# EAGLE design MiniARMBoard (EAGLE 8.7.1)
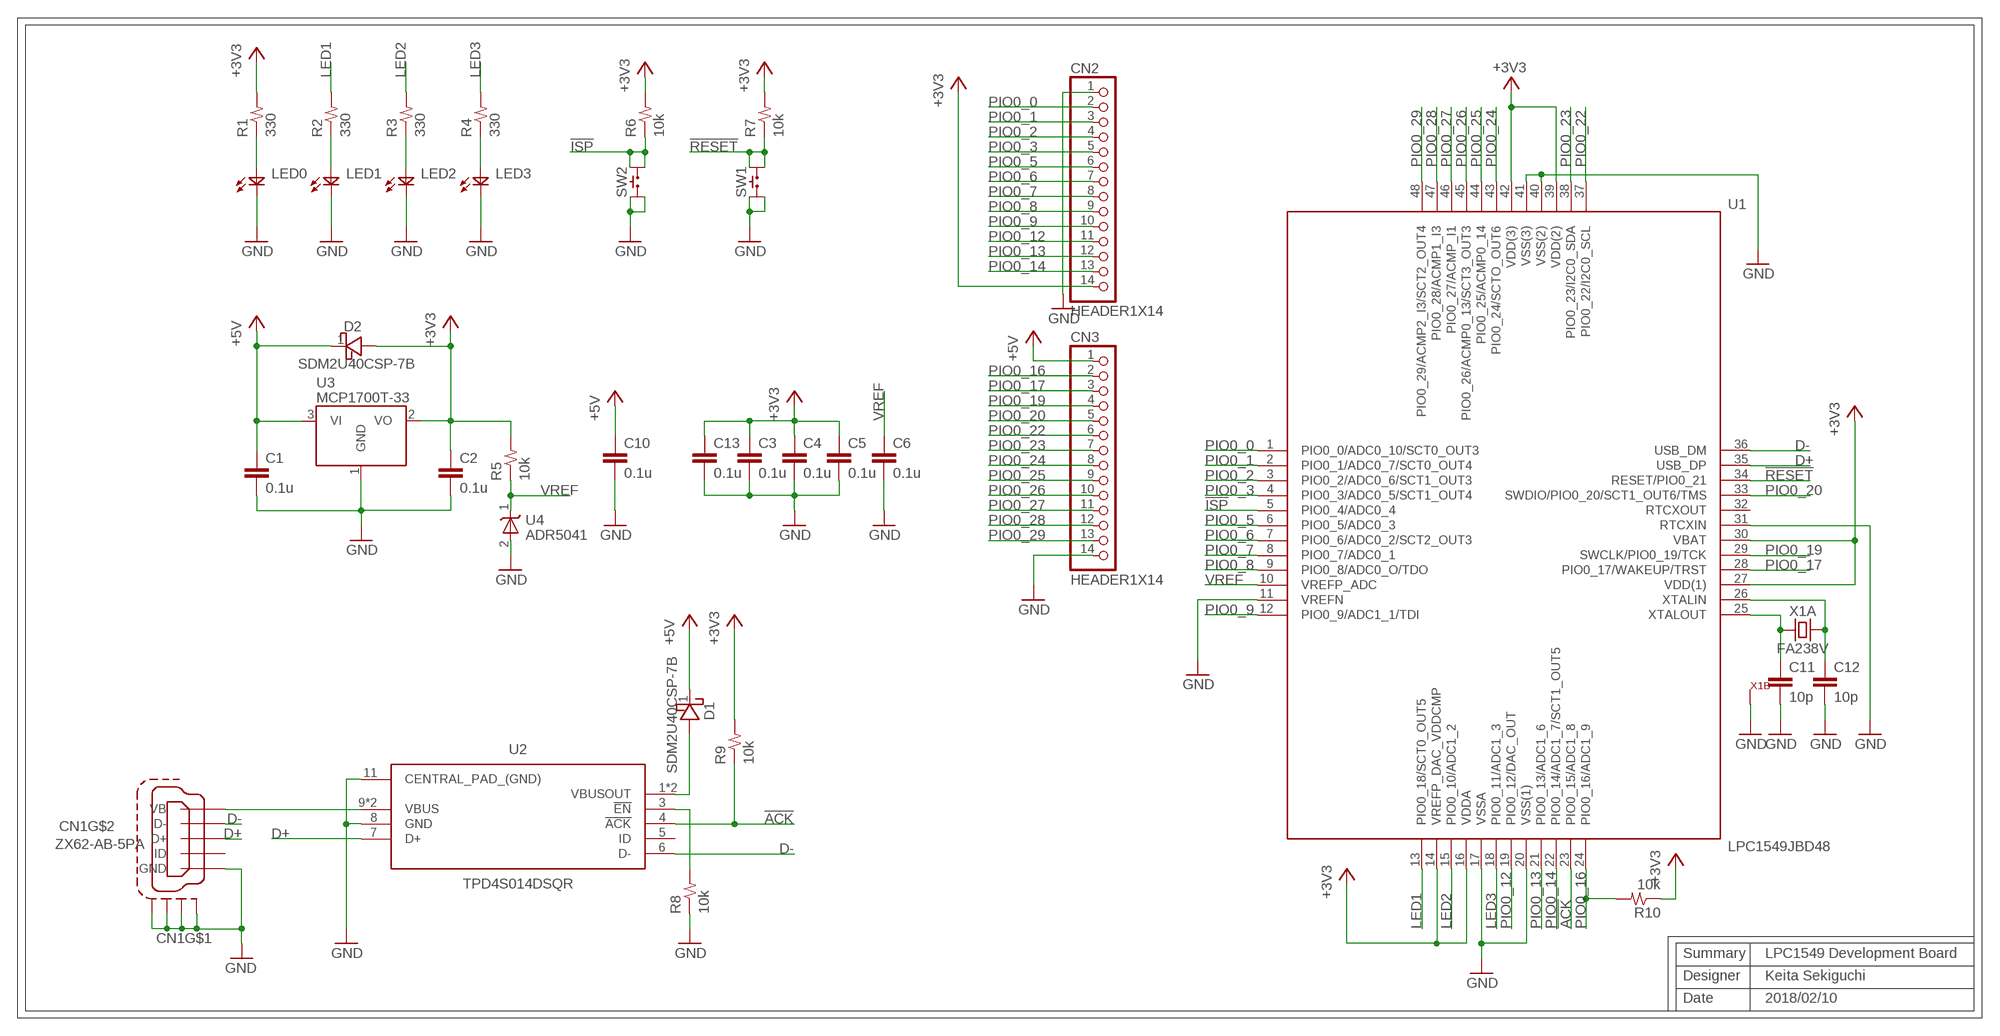
[diagram p0: schematic, sheet 1]

## Parts
C1  0.1u  C1005  [C1005]
C2  0.1u  C1005  [C1005]
C3  0.1u  C1005  [C1005]
C4  0.1u  C1005  [C1005]
C5  0.1u  C1005  [C1005]
C6  0.1u  C1005  [C1005]
C10  0.1u  C1005  [C1005]
C11  10p  C1005  [C1005]
C12  10p  C1005  [C1005]
C13  0.1u  C1005  [C1005]
CN1  ZX62-AB-5PA  J_USB_MICROAB_HIROSE_ZX62-AB-5PA  [J_USB_MICROAB_HIROSE_ZX62-AB-5PA]
CN2  HEADER1X14  [1X14_ROUND]
CN3  HEADER1X14  [1X14_ROUND]
D1  SDM2U40CSP-7B  [X3-WLB1608-2]
D2  SDM2U40CSP-7B  [X3-WLB1608-2]
LED0  LED1608  [LED1608]
LED1  LED1608  [LED1608]
LED2  LED1608  [LED1608]
LED3  LED1608  [LED1608]
R1  330  R1005  [R1005]
R2  330  R1005  [R1005]
R3  330  R1005  [R1005]
R4  330  R1005  [R1005]
R5  10k  R1005  [R1005]
R6  10k  R1005  [R1005]
R7  10k  R1005  [R1005]
R8  10k  R1005  [R1005]
R9  10k  R1005  [R1005]
R10  10k  R1005  [R1005]
SW1  SKRP  [SKRP]
SW2  SKRP  [SKRP]
U1  LPC1549JBD48  [QFP48]
U2  TPD4S014DSQR  [SON40P200X200X80-11N]
U3  MCP1700T-33  [SOT23-3]
U4  ADR5041  [SC70-3]
X1  FA238V  [EPSON_FA238V]

## Nets
!ACK: R9.1 U1.23(PIO0_15/ADC1_8) U2.4(!ACK)
!ISP: R6.1 SW2.B1 SW2.B2 U1.5(PIO0_4/ADC0_4)
!RESET: R7.1 SW1.B1 SW1.B2 U1.34(RESET/PIO0_21)
+3V3: C2.1 C3.1 C4.1 C5.1 C13.1 CN2.14 D2.2(A) R1.2 R5.2 R6.2 R7.2 R9.2 R10.1 U1.14(VREFP_DAC_VDDCMP) U1.16(VDDA) U1.27(VDD(1)) U1.30(VBAT) U1.39(VDD(2)) U1.42(VDD(3)) U3.2(VO)
+5V: C1.1 C10.1 CN3.1 D1.1(K) D2.1(K) U3.3(VI)
D+: CN1.P$3(D+) U1.35(USB_DP) U2.7(D+)
D-: CN1.P$2(D-) U1.36(USB_DM) U2.6(D-)
GND: C1.2 C2.2 C3.2 C4.2 C5.2 C6.2 C10.2 C11.2 C12.2 C13.2 CN1.P$5(GND) CN1.SHIELD1(S1) CN1.SHIELD2(S2) CN1.SHIELD3(S3) CN1.SHIELD4(S4) CN2.1 CN3.14 LED0.K LED1.K LED2.K LED3.K R8.1 SW1.A1 SW1.A2 SW2.A1 SW2.A2 U1.11(VREFN) U1.17(VSSA) U1.20(VSS(1)) U1.31(RTCXIN) U1.40(VSS(2)) U1.41(VSS(3)) U2.8(GND) U2.11(CENTRAL_PAD_(GND)) U3.1(GND) U4.2(A) X1.2 X1.4
LED1: R2.2 U1.13(PIO0_18/SCT0_OUT5)
LED2: R3.2 U1.15(PIO0_10/ADC1_2)
LED3: R4.2 U1.18(PIO0_11/ADC1_3)
N$1: C11.1 U1.25(XTALOUT) X1.1
N$2: C12.1 U1.26(XTALIN) X1.3
N$3: D1.2(A) U2.1(VBUSOUT) U2.2(VBUSOUT)
N$6: R8.2 U2.3(!EN)
N$8: LED0.A R1.1
N$9: LED2.A R3.1
N$16: LED3.A R4.1
N$21: LED1.A R2.1
N$56: CN1.P$1(VB) U2.9(VBUS) U2.10(VBUS)
PIO0_0: CN2.2 U1.1(PIO0_0/ADC0_10/SCT0_OUT3)
PIO0_1: CN2.3 U1.2(PIO0_1/ADC0_7/SCT0_OUT4)
PIO0_2: CN2.4 U1.3(PIO0_2/ADC0_6/SCT1_OUT3)
PIO0_3: CN2.5 U1.4(PIO0_3/ADC0_5/SCT1_OUT4)
PIO0_5: CN2.6 U1.6(PIO0_5/ADC0_3)
PIO0_6: CN2.7 U1.7(PIO0_6/ADC0_2/SCT2_OUT3)
PIO0_7: CN2.8 U1.8(PIO0_7/ADC0_1)
PIO0_8: CN2.9 U1.9(PIO0_8/ADC0_O/TDO)
PIO0_9: CN2.10 U1.12(PIO0_9/ADC1_1/TDI)
PIO0_12: CN2.11 U1.19(PIO0_12/DAC_OUT)
PIO0_13: CN2.12 U1.21(PIO0_13/ADC1_6)
PIO0_14: CN2.13 U1.22(PIO0_14/ADC1_7/SCT1_OUT5)
PIO0_16: CN3.2 R10.2 U1.24(PIO0_16/ADC1_9)
PIO0_17: CN3.3 U1.28(PIO0_17/WAKEUP/TRST)
PIO0_19: CN3.4 U1.29(SWCLK/PIO0_19/TCK)
PIO0_20: CN3.5 U1.33(SWDIO/PIO0_20/SCT1_OUT6/TMS)
PIO0_22: CN3.6 U1.37(PIO0_22/I2C0_SCL)
PIO0_23: CN3.7 U1.38(PIO0_23/I2C0_SDA)
PIO0_24: CN3.8 U1.43(PIO0_24/SCTO_OUT6)
PIO0_25: CN3.9 U1.44(PIO0_25/ACMP0_14)
PIO0_26: CN3.10 U1.45(PIO0_26/ACMP0_13/SCT3_OUT3)
PIO0_27: CN3.11 U1.46(PIO0_27/ACMP_I1)
PIO0_28: CN3.12 U1.47(PIO0_28/ACMP1_I3)
PIO0_29: CN3.13 U1.48(PIO0_29/ACMP2_I3/SCT2_OUT4)
VREF: C6.1 R5.1 U1.10(VREFP_ADC) U4.1(K)
Unconnected: CN1.P$4(ID) U1.32(RTCXOUT) U2.5(ID)

## Notes on the sheet
- Summary | LPC1549 Development Board
- Designer | Keita Sekiguchi
- Date | 2018/02/10

## Library data of the parts
C1-C6 C10-C13 = MotorDriver:C
CN1 = j_usb_hirose_zx62-ab-5pa:J_USB_MICROAB_HIROSE_ZX62-AB-5PA: USB Micro-AB SMT connector Hirose Electric Co Ltd: ZX62-AB-5P
CN2 CN3 = nonolith:HEADER1X14
D1 D2 = SDM2U40CSP-7B:SDM2U40CSP-7B: 2A SCHOTTKY BARRIER RECTIFIER CHIP SCALE PACKAGE Source: Datasheet <https://www.diodes.com/assets/Datasheets/SDM2U40CSP.pdf>; DESCRIPTION: 2A SCHOTTKY BARRIER RECTIFIER CHIP SCALE PACKAGE; HEIGHT: mm; MANUFACTURER_NAME: Diodes Inc.; MANUFACTURER_PART_NUMBER: SDM2U40CSP-7B; SUPPLIER_NAME: RS
LED0 LED1-LED3 = MotorDriver:LED
R1-R10 = MotorDriver:R
SW1 SW2 = MotorDriver:SKRP
U1 = MotorDriver:LPC1549JBD48: NXP - LPC1549JBD48 - 32BIT MCU, CORTEX-M3, 72 MHZ, LQFP-48 Source: Datasheet <http://www.farnell.com/datasheets/1963077.pdf>; DESCRIPTION: NXP - LPC1549JBD48 - 32BIT MCU, CORTEX-M3, 72 MHZ, LQFP-48; HEIGHT: 1.6mm; MANUFACTURER_NAME: NXP; MANUFACTURER_PART_NUMBER: LPC1549JBD48; SUPPLIER_NAME: RS
U2 = TPD4S014DSQR:TPD4S014DSQR: Texas Instruments TPD4S014DSQR, USB Controller, 480Mbit/s, USB 2.0, 10-Pin SON <https://componentsearchengine.com/Images/3/TPD4S014DSQR.jpg> Source: Datasheet <http://www.ti.com/lit/gpn/tpd4s014>; DESCRIPTION: Texas Instruments TPD4S014DSQR, USB Controller, 480Mbit/s, USB 2.0, 10-Pin SON; HEIGHT: 0.8mm; MANUFACTURER_NAME: Texas Instruments; MANUFACTURER_PART_NUMBER: TPD4S014DSQR; RS_PART_NUMBER: 7422968; SUPPLIER_NAME: RS
U3 = MotorDriver:MCP1700T-*
U4 = MotorDriver:ADR504*
X1 = FA238V:FA238V: MHz RANGE CRYSTAL UNIT Source: Datasheet <https://support.epson.biz/td/api/doc_check.php?mode=dl&lang=en&Parts=FA-238V>; DESCRIPTION: MHz RANGE CRYSTAL UNIT; HEIGHT: mm; MANUFACTURER_NAME: Epson ICs; MANUFACTURER_PART_NUMBER: FA238V; SUPPLIER_NAME: RS

## Board
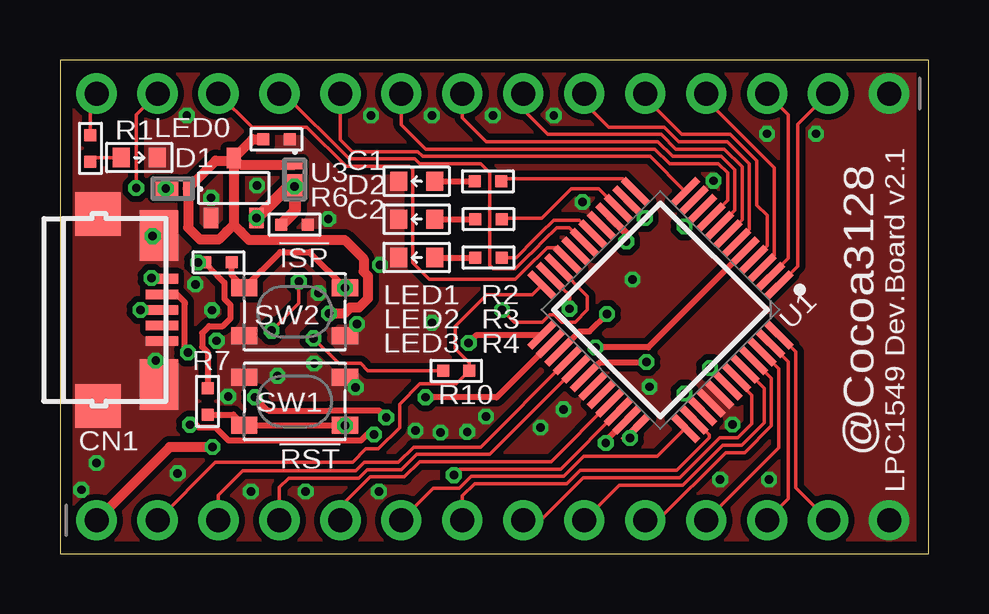
[diagram p1: board, top side]
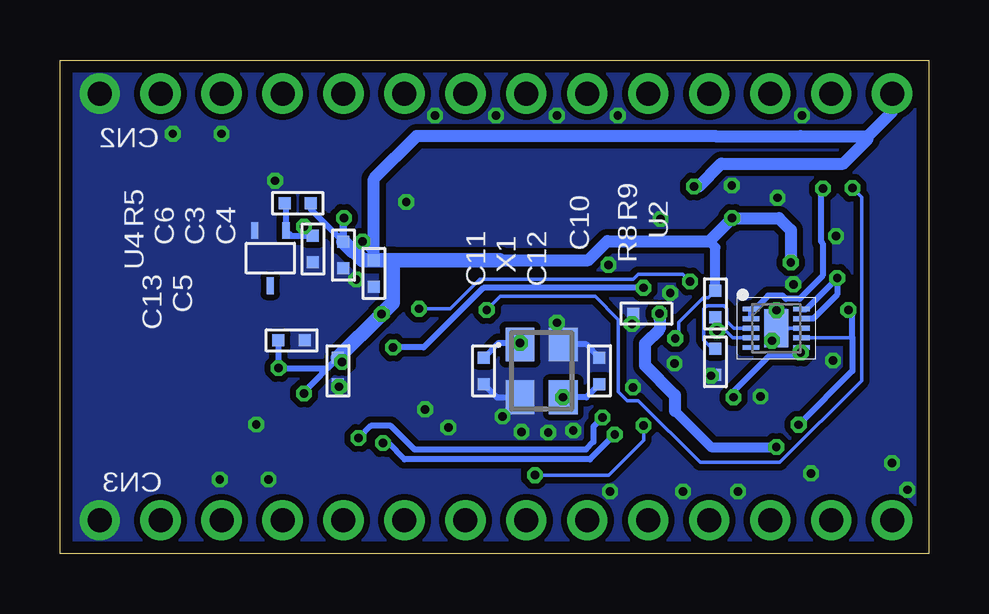
[diagram p2: board, bottom side, seen from below]

Size 36.2 x 20.57 mm. Coordinates in mm from the lower left corner, seen from the top.
Outline: 0,0 36.2,0 36.2,20.57 0,20.57 0,0
Copper layers (1*16): Top 0.035mm / dielectric 1.6mm / Bottom 0.035mm
Design rules "Elecrow_2-layer_PCB_eagle_rule": minimum track width 6mil, minimum drill 12mil, track to track 6mil, track to pad 6mil, pad to pad 6mil, via to via 8mil, smd to smd 0mil, copper to edge 20mil, drill to drill 10mil, minimum pad ring 6mil, minimum via ring 6mil, stop-mask expansion 0mil, vias tented up to drill 100mil, thermal gap 10mil

### Footprints (pad centres in the part's own frame; a part is rotated, then mirrored left to right if it is on the bottom)
C1005 = smd 0.5 x 0.5: 1 -0.55,0; 2 0.55,0
J_USB_MICROAB_HIROSE_ZX62-AB-5PA = smd 0.4 x 1.35: P$1 -1.3,4.125; P$2 -0.65,4.125; P$3 0,4.125; P$4 0.65,4.125; P$5 1.3,4.125 | smd 1.8 x 1.9: SHIELD1 -4,1.45; SHIELD4 4,1.45 | smd 2.1 x 1.6: SHIELD2 -3.1,4; SHIELD3 3.1,4
1X14_ROUND = drill 1 pad 1.676: 1 -16.51,0; 2 -13.97,0; 3 -11.43,0; 4 -8.89,0; 5 -6.35,0; 6 -3.81,0; 7 -1.27,0; 8 1.27,0; 9 3.81,0; 10 6.35,0; 11 8.89,0; 12 11.43,0; 13 13.97,0; 14 16.51,0
X3-WLB1608-2 = smd 0.385 x 0.69: 1 -0.619,0 | smd 1.035 x 0.69: 2 0.293,0
LED1608 = smd 0.7 x 0.8: A 0.75,0; K -0.75,0
R1005 = smd 0.5 x 0.5: 1 -0.55,0; 2 0.55,0
SKRP = smd 1.1 x 0.7: A1 -2.1,-1; A2 2.1,-1; B1 -2.1,1; B2 2.1,1
QFP48 = smd 1.45 x 0.3: 1 -4.225,2.75; 2 -4.225,2.25; 3 -4.225,1.75; 4 -4.225,1.25; 5 -4.225,0.75; 6 -4.225,0.25; 7 -4.225,-0.25; 8 -4.225,-0.75; 9 -4.225,-1.25; 10 -4.225,-1.75; 11 -4.225,-2.25; 12 -4.225,-2.75; 25 4.225,-2.75; 26 4.225,-2.25; 27 4.225,-1.75; 28 4.225,-1.25; 29 4.225,-0.75; 30 4.225,-0.25; 31 4.225,0.25; 32 4.225,0.75; 33 4.225,1.25; 34 4.225,1.75; 35 4.225,2.25; 36 4.225,2.75 | smd 0.3 x 1.45: 13 -2.75,-4.225; 14 -2.25,-4.225; 15 -1.75,-4.225; 16 -1.25,-4.225; 17 -0.75,-4.225; 18 -0.25,-4.225; 19 0.25,-4.225; 20 0.75,-4.225; 21 1.25,-4.225; 22 1.75,-4.225; 23 2.25,-4.225; 24 2.75,-4.225; 37 2.75,4.225; 38 2.25,4.225; 39 1.75,4.225; 40 1.25,4.225; 41 0.75,4.225; 42 0.25,4.225; 43 -0.25,4.225; 44 -0.75,4.225; 45 -1.25,4.225; 46 -1.75,4.225; 47 -2.25,4.225; 48 -2.75,4.225
SON40P200X200X80-11N = smd 0.7 x 0.2: 1 -1.05,0.8; 2 -1.05,0.4; 3 -1.05,0; 4 -1.05,-0.4; 5 -1.05,-0.8; 6 1.05,-0.8; 7 1.05,-0.4; 8 1.05,0; 9 1.05,0.4; 10 1.05,0.8 | smd 1 x 1.6: 11 0,0
SOT23-3 = smd 0.6 x 0.85: 1 -0.95,-1.25; 2 0.95,-1.25; 3 0,1.25
SC70-3 = smd 0.3 x 0.7: 1 -0.65,-1.15; 2 0.65,-1.15; 3 0,1.15
EPSON_FA238V = smd 1.4 x 1.2: 1 -1.1,-0.9; 2 1.1,-0.9; 3 1.1,0.9; 4 -1.1,0.9

### Placement (x,y rotation side)
C1  9.02,17.27 0 top
C2  9.78,13.72 0 top
C3  24.38,12.45 270 bottom
C4  23.11,11.68 270 bottom
C5  24.61,7.62 270 bottom
C6  25.65,12.7 270 bottom
C10  11.76,10.01 180 bottom
C11  18.54,7.62 270 bottom
C12  13.72,7.62 90 bottom
C13  26.54,8.89 0 bottom
CN1  0.13,10.16 270 top
CN2  18.03,19.18 180 top
CN3  18.03,1.4 0 top
D1  4.7,15.21 180 top
D2  9.78,15.6 270 top
LED0  3.3,16.51 180 top
LED1  14.86,15.52 0 top
LED2  14.86,13.94 0 top
LED3  14.86,12.34 0 top
R1  1.27,16.89 90 top
R2  17.83,15.52 0 top
R3  17.86,13.94 0 top
R4  17.86,12.34 0 top
R5  26.29,14.61 0 bottom
R6  6.6,12.14 180 top
R7  6.15,6.35 90 top
R8  8.89,8 90 bottom
R9  8.89,10.41 90 bottom
R10  16.51,7.62 0 top
SW1  9.78,6.35 180 top
SW2  9.78,10.08 0 top
U1  25.02,10.16 225 top
U2  6.35,9.4 0 bottom
U3  7.24,15.24 0 top
U4  27.43,12.32 180 bottom
X1  16.13,7.62 270 bottom

### Tracks (layer width: path | path; a pad name or v marks a point on that pad's centre or on a via)
!ACK  (via drill 0.35)
  Top 0.152: U1.23 20.95,11.05 21.23,10.77 v21.23,10.21 | v9.95,11.35 9.95,10.43 v8.81,9.3
  Bottom 0.152: R9.1 8.72,9.69 8.72,9.55 8.6,9.44 | 8.6,9.44 8.16,9 U2.4 | v21.23,10.21 19.93,10.21 18.7,11.44 12.31,11.44 12.11,11.64 10.24,11.64 v9.95,11.35 | v8.81,9.3 8.74,9.3 8.6,9.44
!ISP  (via drill 0.35)
  Top 0.254: U1.5 24.52,8.6 v22.31,8.6 | R6.1 7.15,11.61 SW2.B1 9.17,12.57 10.39,12.57 SW2.B2
  Bottom 0.254: v22.31,8.6 21.04,8.6 18.55,11.08 SW2.B2
  other vias: 11.88,11.08
!RESET  (via drill 0.35)
  Top 0.152: SW1.B1 11.86,5.33 | 17.69,3.53 | U1.34 20.86,3.53 17.69,3.53 | 16.66,3.53 v16.41,3.28 | 17.69,3.53 16.66,3.53 | 16.66,3.53
  Top 0.254: SW1.B1 SW1.B2 7.23,5.8 R7.1
  Bottom 0.152: v16.41,3.28 15.47,3.28 13.34,3.28 11.88,4.74 SW1.B1
  other vias: 11.88,5.35
+3V3  (via drill 0.35)
  Top 0.152: CN2.14 1.27,18.92 R1.2 | v10.56,8.98 11.61,7.93 12.52,7.93 12.83,7.62 R10.1
  Top 0.254: v26.02,6.68 U1.39 | v27.09,7.74 | v27.09,7.74 U1.42 | U1.27 21.66,9.27 22.07,9.27 v22.79,9.99 | U1.30 22.43,7.92 22.45,7.92 22.52,7.99 v24.44,7.99 | 27.15,7.74 v27.09,7.74 | v5.75,12.14 6,12.14 6.53,11.61 6.54,11.61 6.85,11.3 6.85,10.62 7.11,10.36 7.11,9.81 6.78,9.48 6.21,9.48 5.92,9.19 5.92,8.63 6.15,8.4 R7.2
  Top 0.305: v23.59,13.01 23.59,13.35 U1.16 | U1.14 v24.37,13.99 | v24.37,13.99
  Top 0.508: U3.2 9.5,15.3 D2.2 9.78,14.27 C2.1 | v5.75,12.14 R6.2
  Bottom 0.152: R9.2 9.19,10.67 9.4,10.67 10.41,9.65 10.41,9.12 v10.56,8.98
  Bottom 0.254: R5.2 25.74,14.35 C3.1 | C5.1 26.02,6.76 v26.02,6.68 | C13.1 27.09,7.75 v27.09,7.74 25.04,7.74 C5.1 | 22.64,10.14 v22.79,9.99 | v24.44,7.99 C5.1
  Bottom 0.305: C4.1 23.11,12.53 v23.59,13.01 | C3.1 24.38,13.98 v24.37,13.99
  Bottom 0.406: R9.2 8.89,12.77 9.15,13.03
  Bottom 0.508: v5.75,12.14 v5.74,12.14 5.74,13.49 6.24,13.99 U3.2 9.15,13.03 13.38,13.03 14.18,12.23 17.86,12.23 | C4.1 23.11,15.62 21.34,17.4 8.89,17.4 5.33,17.4 2.54,17.4 | D2.2 9.59,15.3 8.64,16.26 3.56,16.26 2.54,17.27 2.54,17.4 | 2.54,17.4 1.52,18.42 CN2.14
  Bottom 0.61: 22.33,12.23 17.86,12.23 | 22.33,12.23 C4.1 23.57,12.23 23.95,12.6 23.99,12.6 C3.1 | 22.64,10.14 22.33,10.46 22.33,12.23 | C5.1 v22.79,9.99
  other vias: 8.19,13.99 9.78,15.3
+5V  (via drill 0.35)
  Top 0.406: 7.24,16.38 6.49,16.38 D1.1 5.33,15.2 5.33,13.59 5.84,13.09 6.61,13.09 6.95,13.42 7.24,13.72 | U3.3 7.24,13.72 | U3.3 8.02,17.27 C1.1 | U3.3 7.51,16.21 D2.1 | v6.35,4.45 4.57,4.45 1.57,1.45 | 1.57,1.45 1.57,1.4 | CN3.1 1.57,1.45 | 7.24,13.72 7.53,13.42 7.87,13.08 11.86,13.08 12.65,12.29 12.65,11.76 12.83,11.58 12.83,10.63 12.46,10.26 12.09,10.26 11.84,10.01 C10.1
  Top 0.508: 7.24,16.38 U3.3
  Bottom 0.305: 10.57,6.61 10.55,6.59
  Bottom 0.406: 10.57,5.96 9.06,4.45 v6.35,4.45
  Bottom 0.508: 10.57,5.96 10.57,6.61 11.81,7.85 11.81,8.76 11.21,9.36 C10.1
  other vias: 11.21,10.01
D+  (via drill 0.35)
  Top 0.254: v3.35,10.16 CN1.P$3 | v5.42,5.38 5.67,5.38 5.78,5.27 6.46,5.27 7.01,4.72 12.54,4.72 12.8,4.97 v13.08,4.97 | v22.74,4.62 22.74,4.7 U1.35
  Bottom 0.152: U2.7 3.19,9 3.17,9.02 | 3.16,7.62 3.17,7.62
  Bottom 0.254: v3.35,10.16 3.17,9.99 3.17,9.02 3.17,7.62 v5.42,5.38 | v13.08,4.97 14.12,3.94 21.84,3.94 22.53,4.62 v22.74,4.62
D-  (via drill 0.35)
  Top 0.254: CN1.P$2 4.87,10.81 5.21,10.48 5.21,10.41 5.21,8.51 v5.33,8.38 | v8.13,6.52 8.68,5.97 11.2,5.97 11.21,5.98 13.29,5.98 v13.59,5.67 | v23.75,4.82 23.75,5 U1.36
  Bottom 0.152: v5.33,8.38 5.3,8.42 U2.6
  Bottom 0.254: v5.33,8.38 5.38,8.38 5.54,8.23 6.67,8.23 8.13,6.77 v8.13,6.52 | v13.59,5.67 13.97,5.3 13.97,4.66 14.29,4.34 21.42,4.34 22.41,5.33 23.24,5.33 v23.75,4.82 | v23.75,4.82
GND  (via drill 0.35)
  Bottom 0.152: U2.8 U2.11
  Bottom 0.254: C12.2 14.27,8.72 X1.4 | C11.2 17.99,6.52 X1.2
  other vias: 6.3,14.83 28.02,5.38 12.32,6.93 17.75,5.71 10.59,7.92 0.89,2.67 24.56,6.96 20.98,6.02 3.86,13.23 13.34,12.04 20.02,5.26 23.85,11.43 21.77,14.66 27.23,15.54 16.97,5.08 15.49,9.63 15.85,5.05 14.81,5.13 10.77,10.87 8.2,15.34 1.52,3.78 7.01,6.55 6.53,8.88 9.07,7.42 3.99,8.05 5.64,11.23 12.37,9.58 6.34,10.15 5.28,18.26 11.18,13.94 29.54,3.1 27.51,3.1 13.28,2.59 10.24,2.59 7.95,2.59 4.9,3.35 12.95,18.26 15.49,18.26 18.03,18.26 20.57,18.26 29.46,17.5 31.5,17.5
  pour Bottom (isolate 0.254, rank 6, no thermals): -2.03,24.26 36.32,24.26 36.32,-1.65 -2.03,-1.65
  pour Top (isolate 0.254, rank 6, no thermals): -1.02,23.62 37.21,23.62 37.21,-0.76 -1.02,-0.76
LED1
  Top 0.152: U1.13 23.45,15.62 18.48,15.62 R2.2
LED2
  Top 0.152: U1.15 22.44,15.21 21.31,15.21 20.07,13.97 18.43,13.97 R3.2
LED3
  Top 0.152: U1.18 21.64,13.89 20.57,13.89 20.04,13.37 | 20.04,13.37 | 20.04,13.37 19.48,12.8 19.33,12.66 | 19.33,12.66 | R4.2 19.02,12.34 19.33,12.66
  Top 0.254: R4.2 18.44,12.34
N$1  (via drill 0.35)
  Top 0.254: v17.03,8.78 17.36,9.12 U1.25
  Bottom 0.254: X1.1 v17.03,8.78 17.93,8.78 C11.1
N$2  (via drill 0.35)
  Top 0.254: U1.26 18.2,6.52 X1.3
  Bottom 0.254: C12.1 14.27,6.52 X1.3
  other vias: 15.23,6.52
N$3  (via drill 0.35)
  Top 0.406: D1.2 4.32,15.3
  Bottom 0.254: U2.2 U2.1 7.25,10.2 6.69,10.75 6.09,10.75 5.95,10.62 5.38,10.62 4.42,11.59 4.42,12.93 4.47,12.98 4.47,15.15 D1.2
  other vias: 4.41,15.21
N$6
  Bottom 0.152: U2.3 8.13,9.4 8.41,9.68 8.41,10.21 8.54,10.34 9.23,10.34 9.37,10.21 9.37,8.9 9.02,8.55 R8.2
N$8
  Top 0.152: R1.1 1.44,16.51 LED0.A
N$9
  Top 0.254: LED2.A R3.1
N$16
  Top 0.254: LED3.A R4.1
N$21
  Top 0.254: LED1.A R2.1
N$56  (via drill 0.35)
  Top 0.152: CN1.P$1 3.78,11.46
  Top 0.254: 3.78,11.46 v3.81,11.49
  Top 0.305: 4.17,11.46 CN1.P$1
  Bottom 0.254: U2.10 5.1,10.2 v3.81,11.49 3.81,10.79 4.81,9.8 U2.9
PIO0_0
  Top 0.152: U1.1 30.73,11.99 30.73,17.91 CN2.2
  Top 0.254: U1.1 30.1,11.35
PIO0_1
  Top 0.152: U1.2 30.35,12.31 30.35,18.29 CN2.3
PIO0_2
  Top 0.152: U1.3 29.77,12.44 29.77,16.07 29.34,16.51 | 29.34,16.51 | CN2.4 26.92,18.92 29.34,16.51
PIO0_3
  Top 0.152: U1.4 29.46,12.84 29.46,14.1 29.03,14.53 29.03,16.38 27.94,17.48 25.91,17.48 24.38,19 CN2.5
PIO0_5
  Top 0.152: 28.73,14.04 | 28.73,14.04 28.73,13.52 U1.6 | 28.73,14.04 28.73,16.25 | 28.73,16.25 | 27.56,17.17 27.81,17.17 28.73,16.25 | 27.56,17.17 | 27.56,17.17 25.78,17.17 25.17,17.78 22.86,17.78 21.84,18.8 CN2.6
PIO0_6
  Top 0.152: U1.7 28.42,13.92 28.42,16.13 27.68,16.87 25.65,16.87 25.04,17.48 20.32,17.48 19.3,18.49 CN2.7
PIO0_7
  Top 0.152: U1.8 28.12,14.32 28.12,16 27.56,16.56 25.53,16.56 24.92,17.17 17.75,17.17 16.76,18.16 CN2.8
PIO0_8
  Top 0.152: U1.9 27.81,14.72 27.81,15.88 27.43,16.26 25.4,16.26 24.79,16.87 15.24,16.87 14.22,17.88 CN2.9
PIO0_9
  Top 0.152: U1.12 24.59,16.56 15.11,16.56 14.92,16.76 12.18,16.76 11.68,17.25 CN2.10
PIO0_12
  Top 0.152: U1.19 21.83,12.97 21.21,13.59 20.69,13.59 20.17,13.06 19.78,12.68 | 19.78,12.68 | 19.63,12.53 | 19.63,12.53 19.58,12.48 18.97,11.87 18.06,11.87 17.9,12.03 17.9,15.88 17.53,16.26 14.99,16.26 14.79,16.45 12.05,16.45 9.32,19.18 CN2.11 | 19.78,12.68 19.63,12.53
PIO0_13
  Top 0.152: U1.21 20.65,12.76 20.29,12.76 20.09,12.55 19.94,12.4 | 19.94,12.4 | 19.94,12.4 19.71,12.17 18.98,11.44 15.38,11.44 14.69,12.13 14.69,16.01 14.55,16.15 11.92,16.15 10.29,17.78 8,17.78 CN2.12
PIO0_14  (via drill 0.35)
  Top 0.152: CN2.13 3.17,18.29 v3.17,15.24 | U1.22 21.97,10.73 21.97,10.16 21.46,9.65 20.9,9.65 20.59,9.96 20.4,9.96 20.09,9.65 18.92,9.65 v18.41,10.16
  Bottom 0.152: v18.41,10.16 17.85,10.73 13.9,10.73 12.93,9.75 12.93,6.75 12.55,6.38 12.09,6.38 9.53,3.81 6.2,3.81 2.79,7.22 2.79,14.86 v3.17,15.24
PIO0_16
  Top 0.152: U1.24 19.68,10.79 17.78,10.79 16.47,9.49 16.47,8.55 17.06,7.96 R10.2 16.52,7.08 15,7.08 14.15,6.23 14.15,5.25 13.26,4.37 12.75,4.37 12.19,3.81 6.48,3.81 CN3.2
PIO0_17
  Top 0.152: 7.61,3.45 7.62,3.45 | 7.62,3.45 12.31,3.45 12.67,3.81 14.1,3.81 14.73,4.45 17.53,4.45 21.14,8.06 U1.28 | 7.62,3.45 6.6,2.44 CN3.3
PIO0_19
  Top 0.152: 16.41,4.14 14.86,4.14 14.22,3.5 12.8,3.5 12.44,3.15 9.53,3.15 9.14,2.77 CN3.4 | U1.29 21.47,7.7 17.91,4.14 16.41,4.14 | 16.41,4.14
PIO0_20
  Top 0.152: U1.33 20.46,3.83 17.81,3.83 | 16.54,3.83 14.98,3.83 14.35,3.2 12.93,3.2 11.68,1.96 CN3.5 | 16.54,3.83 | 16.54,3.83 17.81,3.83 | 17.81,3.83
PIO0_22
  Top 0.152: U1.37 24.89,4.06 21.83,4.06 20.99,3.23 17.14,3.23 16.64,2.72 15.55,2.72 CN3.6
PIO0_23
  Top 0.152: U1.38 26.92,5.08 27.05,4.95 27.05,4.83 25.7,3.48 21.67,3.48 21.12,2.92 17.27,2.92 16.76,2.41 CN3.7
PIO0_24
  Top 0.152: U1.43 28.18,7.25 28.83,6.6 28.83,5.41 28.25,4.83 27.48,4.83 25.83,3.17 21.8,3.17 20.02,1.4 CN3.8
PIO0_25
  Top 0.152: U1.44 29.34,6.9 29.34,5.46 28.4,4.52 27.61,4.52 25.95,2.87 23.31,2.87 CN3.9
PIO0_26
  Top 0.152: U1.45 29.64,7.3 29.64,5.33 28.53,4.22 27.74,4.22 24.91,1.4 CN3.10
PIO0_27
  Top 0.152: 29.95,6.65 | U1.46 29.95,7.71 29.95,6.65 | CN3.11 29.95,4.42 29.95,6.65
PIO0_28
  Top 0.152: U1.47 30.35,8.01 30.35,2.29 CN3.12
PIO0_29
  Top 0.152: U1.48 30.66,8.41 30.66,2.74 | 30.66,2.74 | 30.66,2.74 CN3.13
VREF  (via drill 0.35)
  Top 0.254: v26.02,13.64 U1.10
  Bottom 0.254: v26.02,13.64 25.65,13.27 C6.1 26.56,13.25 U4.1 26.78,14.55 R5.1

### Text on the board
tNames: !ISP | !RST | @Cocoa3128 | LPC1549 Dev.Board v2.1